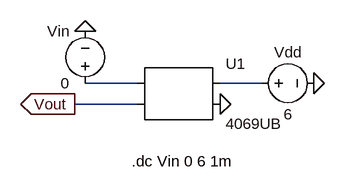
[diagram p0: schematic Q2.asc]
Q2.asc, the LTspice schematic file:
Version 4
SHEET 1 880 680
WIRE 176 192 96 192
WIRE 368 192 304 192
WIRE 176 224 80 224
FLAG 80 224 Vout
IOPIN 80 224 Out
FLAG 448 192 0
FLAG 304 224 0
FLAG 96 112 0
SYMBOL voltage 352 192 R270
WINDOW 0 32 56 VTop 2
WINDOW 3 -32 56 VBottom 2
WINDOW 123 0 0 Left 0
WINDOW 39 0 0 Left 0
SYMATTR InstName Vdd
SYMATTR Value 6
SYMBOL AutoGenerated\\4069UB 240 208 R0
SYMATTR InstName U1
SYMBOL voltage 96 208 R180
WINDOW 0 24 96 Left 2
WINDOW 3 24 16 Left 2
WINDOW 123 0 0 Left 0
WINDOW 39 0 0 Left 0
SYMATTR InstName Vin
SYMATTR Value 0
TEXT 168 312 Left 2 !.dc Vin 0 6 1m

The netlist it stands for:
* Q2.asc
Vdd N002 0 6
* U1: 4069UB (symbol AutoGenerated\4069UB not available, pins judged from their places): pin1=N001 pin2=Vout pin3=N002 pin4=0
Vin N001 0 0
.dc Vin 0 6 1m
.backanno
.end